# EAGLE schematic stm32hw01 (EAGLE 6.6.0)
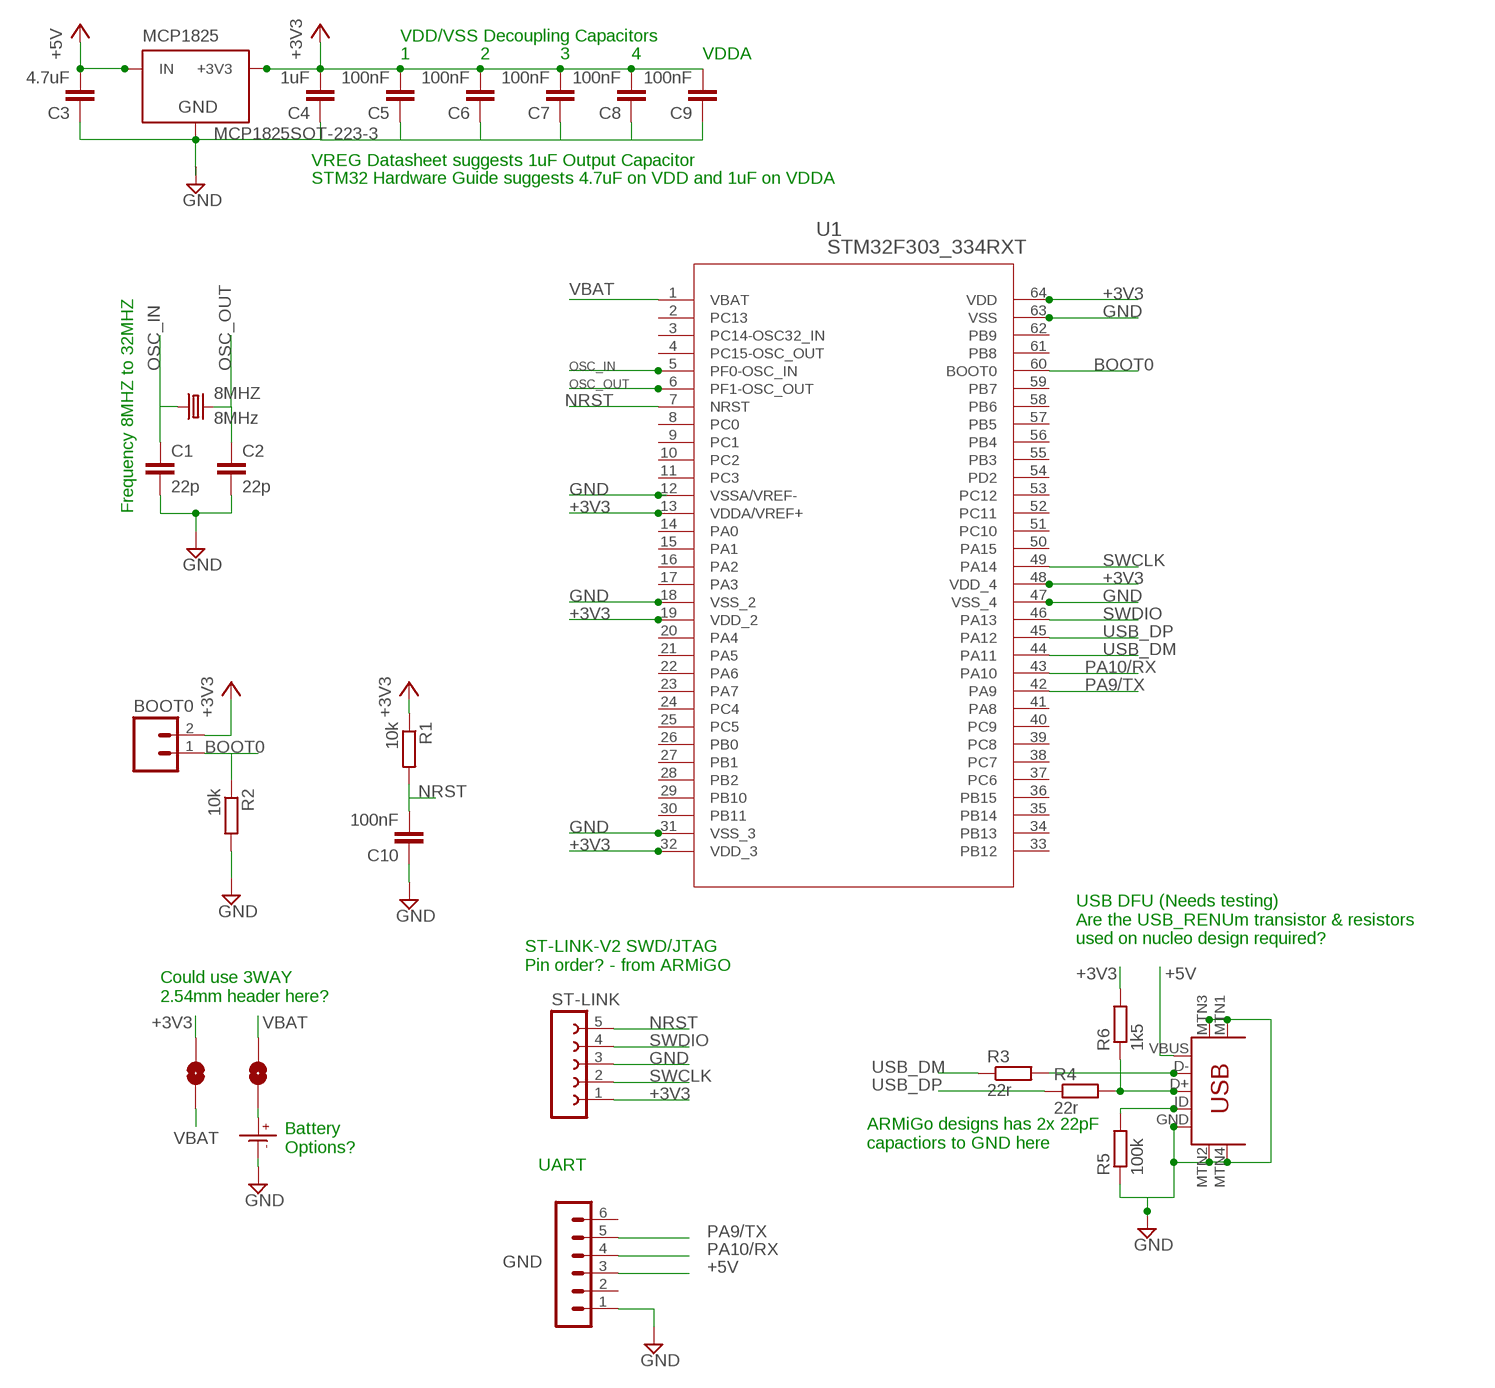
[diagram p0: schematic, sheet 1]

## Parts
3V3  SOLDERJUMPERNO  [SJ_2S-NO]
8MHZ  8MHz  CRYSTAL5X3  [CRYSTAL-SMD-5X3]
BATTERY  SOLDERJUMPERNO  [SJ_2S-NO]
BOOT0  M02PTH  [1X02]
C1  22p  C-EUC0603  [C0603]
C2  22p  C-EUC0603  [C0603]
C3  4.7uF  C-EUC0603  [C0603]
C4  1uF  C-EUC0603  [C0603]
C5  100nF  C-EUC0603  [C0603]
C6  100nF  C-EUC0603  [C0603]
C7  100nF  C-EUC0603  [C0603]
C8  100nF  C-EUC0603  [C0603]
C9  100nF  C-EUC0603  [C0603]
C10  100nF  C-EUC0603  [C0603]
CR1220  CR1220SMD  [CR1220SMD]
GND  UART  MA06-1  [MA06-1]
MCP1825  MCP1825SOT-223-3  [SOT-223]
R1  10k  R-EU_R0603  [R0603]
R2  10k  R-EU_R0603  [R0603]
R3  22r  R-EU_R0603  [R0603]
R4  22r  R-EU_R0603  [R0603]
R5  100k  R-EU_R0603  [R0603]
R6  1k5  R-EU_R0603  [R0603]
ST-LINK  FE05-1  [FE05-1]
U1  STM32F303_334RXT  [LQFP64-10X10MM]
U$10  USB-MINIB-5PIN  [USB-MINIB-CISECO]

## Nets
+3V3: 3V3.1 BOOT0.2 C4.2 C5.2 C6.2 C7.2 C8.2 C9.2 MCP1825.3(+3V3) R1.1 R6.2 ST-LINK.1 U1.13(VDDA/VREF+) U1.19(VDD_2) U1.32(VDD_3) U1.48(VDD_4) U1.64(VDD)
+5V: C3.2 GND.3 MCP1825.1(IN) U$10.VBUS
BOOT0: BOOT0.1 R2.1 U1.60(BOOT0)
GND: C1.2 C2.2 C3.1 C4.1 C5.1 C6.1 C7.1 C8.1 C9.1 C10.1 CR1220.P-(P$-) GND.1 MCP1825.2(GND) R2.2 R5.1 ST-LINK.3 U1.12(VSSA/VREF-) U1.18(VSS_2) U1.31(VSS_3) U1.47(VSS_4) U1.63(VSS) U$10.GND U$10.MTN1(MTN2) U$10.MTN2(MTN3) U$10.MTN3(MTN1) U$10.MTN4
N$1: BATTERY.2 CR1220.P+(P$+)
N$3: R5.2 U$10.ID
N$6: R4.2 R6.1 U$10.D+
N$7: R3.2 U$10.D-
NRST: C10.2 R1.2 ST-LINK.5 U1.7(NRST)
OSC_IN: 8MHZ.1 C1.1 U1.5(PF0-OSC_IN)
OSC_OUT: 8MHZ.3 C2.1 U1.6(PF1-OSC_OUT)
PA9/TX: GND.5 U1.42(PA9)
PA10/RX: GND.4 U1.43(PA10)
SWCLK: ST-LINK.2 U1.49(PA14)
SWDIO: ST-LINK.4 U1.46(PA13)
USB_DM: R3.1 U1.44(PA11)
USB_DP: R4.1 U1.45(PA12)
VBAT: 3V3.2 BATTERY.1 U1.1(VBAT)
Unconnected: GND.2 GND.6 U1.2(PC13) U1.3(PC14-OSC32_IN) U1.4(PC15-OSC_OUT) U1.8(PC0) U1.9(PC1) U1.10(PC2) U1.11(PC3) U1.14(PA0) U1.15(PA1) U1.16(PA2) U1.17(PA3) U1.20(PA4) U1.21(PA5) U1.22(PA6) U1.23(PA7) U1.24(PC4) U1.25(PC5) U1.26(PB0) U1.27(PB1) U1.28(PB2) U1.29(PB10) U1.30(PB11) U1.33(PB12) U1.34(PB13) U1.35(PB14) U1.36(PB15) U1.37(PC6) U1.38(PC7) U1.39(PC8) U1.40(PC9) U1.41(PA8) U1.50(PA15) U1.51(PC10) U1.52(PC11) U1.53(PC12) U1.54(PD2) U1.55(PB3) U1.56(PB4) U1.57(PB5) U1.58(PB6) U1.59(PB7) U1.61(PB8) U1.62(PB9)

## Notes on the sheet
- VDD/VSS Decoupling Capacitors
- 1 | 2 | 3 | 4 | VDDA
- VREG Datasheet suggests 1uF Output Capacitor
- STM32 Hardware Guide suggests 4.7uF on VDD and 1uF on VDDA
- Frequency 8MHZ to 32MHZ
- USB DFU (Needs testing)
  Are the USB_RENUm transistor & resistors 
  used on nucleo design required?
- ST-LINK-V2 SWD/JTAG
  Pin order? - from ARMiGO
- Could use 3WAY
  2.54mm header here?
- ARMiGo designs has 2x 22pF
  capactiors to GND here
- Battery
  Options?
- UART

## Library data of the parts
3V3 BATTERY = SparkFun:SOLDERJUMPER: Solder Jumper Standard SMD solder jumper. Used to automate production. Two varients : Normally Open and Normally Closed are the same, but have different paste layers. NC will have a large amount of paste and should jumper during reflow.
8MHZ = SparkFun:CRYSTAL: Crystals Various standard crystals. Proven footprints. Spark Fun Electronics SKU : COM-00534
BOOT0 = SparkFun:M02: Header 2 Standard 2-pin 0.1" header. Use with straight break away headers (SKU : PRT-00116), right angle break away headers (PRT-00553), swiss pins (PRT-00743), machine pins (PRT-00117), and female headers (PRT-00115). Molex polarized connector foot print use with SKU : PRT-08233 with associated crimp pins and housings.
C1-C10 = resistor:C-EU: CAPACITOR, European symbol
CR1220 = IotaWatt_parts:CR1220SMD: CR1220 Battery SMD; MPN: Harwin S8411-45R
GND = JeeLabs:MA06-1: PIN HEADER
MCP1825 = SteelCaveRobotics-Power:MCP1825: MCP1825 3.3v LDO Linear Regulator
R1-R6 = resistor:R-EU_: RESISTOR, European symbol
ST-LINK = con-lsta:FE05-1: FEMALE HEADER; OC_FARNELL: unknown; OC_NEWARK: unknown
U1 = stm32f303:STM32F303_334RXT; MANUFACTURER_PART_NUMBER: stm32f303_334rxt; VENDOR: STMicroelectronics
U$10 = Ciseco USB miniB_Updated:USB-MINIB: Mini-USB "B" connector with 5th pin broken out. Created new symbol breaking out 5th "ID" pin in mini/micro USB connector spec. See: http://en.wikipedia.org/wiki/Mini_usb#Cables. Uses same footprint as 4-pin symbol. Also added pins to connect to mounting / shield pads if required (probably not generally needed as signals aren't shielded once they leave the connector). Modified by Ciseco for Rapid Part 24-0357

## Net classes
0 default: width 0.203 mm, drill 0.6 mm, clearance 0.203 mm
1 power: width 0.381 mm, drill 0.6 mm, clearance 0.254 mm
2 gnd: width 0.254 mm, drill 0.6 mm, clearance 0.254 mm